# Altium schematic sheet Main.SchDoc
size A; SheetNumber: 1; SheetTotal: 2
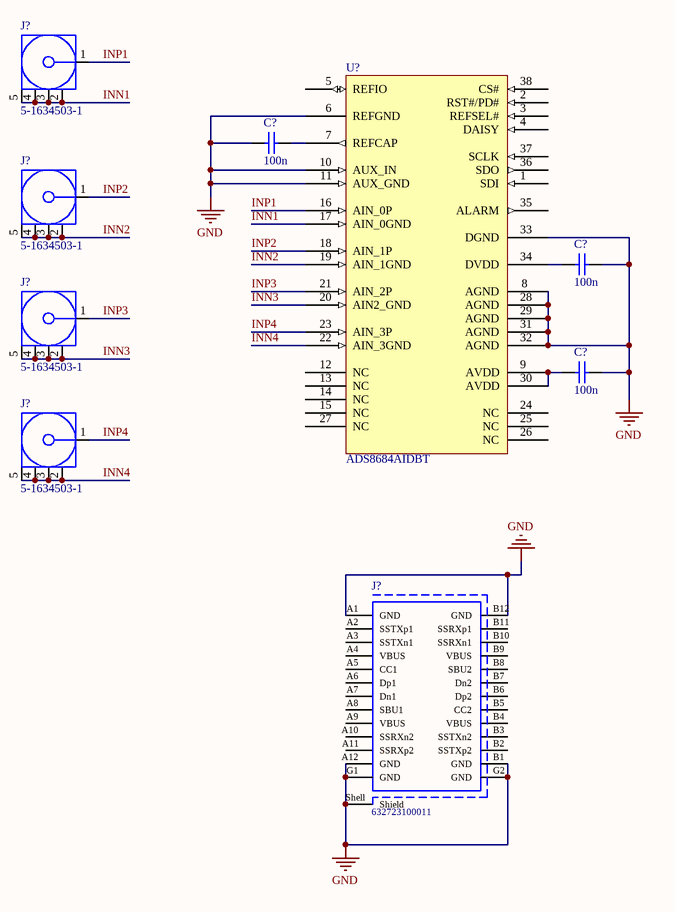
[diagram p0: Main.SchDoc]

## Parts
(Parts that share a designator on the sheet are numbered #1, #2 ... from top to bottom, then left to right.)
C?#1  value 100n  [1608[0603]]  (hidden comment: Cap Semi)
C?#2  value 100n  [1608[0603]]  (hidden comment: Cap Semi)
C?#3  value 100n  [1608[0603]]  (hidden comment: Cap Semi)
J?#1  5-1634503-1  [TECO-5-1634503-1_V]
J?#2  5-1634503-1  [TECO-5-1634503-1_V]
J?#3  5-1634503-1  [TECO-5-1634503-1_V]
J?#4  5-1634503-1  [TECO-5-1634503-1_V]
J?#5  632723100011  [632723100011]
U?  ADS8684AIDBT  [TSSOP50P640X120-38N]

## Nets
GND: C?#1.2 C?#2.2 C?#3.2 J?#5.A1(GND) J?#5.A12(GND) J?#5.B1(GND) J?#5.B12(GND) J?#5.G1(GND) J?#5.G2(GND) J?#5.Shell(Shield) U?.6(REFGND) U?.8(AGND) U?.10(AUX_IN) U?.11(AUX_GND) U?.28(AGND) U?.29(AGND) U?.31(AGND) U?.32(AGND) U?.33(DGND)
INN1: J?#1.2 J?#1.3 J?#1.4 J?#1.5 U?.17(AIN_0GND)
INN2: J?#2.2 J?#2.3 J?#2.4 J?#2.5 U?.19(AIN_1GND)
INN3: J?#3.2 J?#3.3 J?#3.4 J?#3.5 U?.20(AIN2_GND)
INN4: J?#4.2 J?#4.3 J?#4.4 J?#4.5 U?.22(AIN_3GND)
INP1: J?#1.1 U?.16(AIN_0P)
INP2: J?#2.1 U?.18(AIN_1P)
INP3: J?#3.1 U?.21(AIN_2P)
INP4: J?#4.1 U?.23(AIN_3P)
NetC?#1_1: C?#1.1 U?.7(REFCAP)
NetC?#2_1: C?#2.1 U?.34(DVDD)
NetC?#3_1: C?#3.1 U?.9(AVDD) U?.30(AVDD)

Not connected (* = marked no-connect by the designer): J?#5 A2(SSTXp1) A3(SSTXn1) A4(VBUS) A5(CC1) A6(Dp1) A7(Dn1) A8(SBU1) A9(VBUS) A10(SSRXn2) A11(SSRXp2) B2(SSTXp2) B3(SSTXn2) B4(VBUS) B5(CC2) B6(Dp2) B7(Dn2) B8(SBU2) B9(VBUS) B10(SSRXn1) B11(SSRXp1); U? 1(SDI) 2(RST#/PD#) 3(REFSEL#) 4(DAISY) 5(REFIO) 12(NC) 13(NC) 14(NC) 15(NC) 24(NC) 25(NC) 26(NC) 27(NC) 35(ALARM) 36(SDO) 37(SCLK) 38(CS#)

## Library data of the parts
C?#1-C?#3 = Cap Semi: Capacitor (Semiconductor SIM Model); Published: 8-Jun-2000; LatestRevisionDate: 29-May-2009; LatestRevisionNote: IPC-7351 Footprint Added.; PackageReference: C1206; Publisher: Altium Limited; PackageDescription: Chip Capacitor
J?#1-J?#4 = CMP-2000-05626-1: Female Header, Pitch 3.13 mm, Height 13.7 mm, Tail Length 4.5 mm, -55 to 85 degC, RoHS, Bulk; Manufacturer: TE Connectivity; Connector Body Style: StraightJack; Coaxial Termination: Solder; Connector Type: BNCCoaxial; Impedance: 50ohm; Connector Mounting: PCBMount; Frequency Max: 2GHz; SVHC: NoSVHC(15-Jun-2015); Product Range: -; Package Description: Female Header, Pitch 3.13 mm, Height 13.7 mm, Tail Length 4.5 mm; Coaxial Cable Types: -; Manufacturer URL: http://www.te.com/; Mounting Technology: ThroughHole; Datasheet URL: http://www.mouser.com/ds/2/418/NG_CD_1634503_E-657474.pdf; Package Reference: 5-1634503-1; Contact Plating: GoldPlatedContacts; Contact Material: Brass; Datasheet Version: Rev. E, 02/2012
J?#5 = CMP-1502-03213-1: USB 3.1 Type C Receptacle WR-COM, Horizontal, SMT / THT; Manufacturer: Wurth Elektronik; Working Voltage: 20VDC; Rated Current: 5A; Contact Resistance: 30mOhm; Operating Temperature: -40to105degC; Publisher: WurthElektronik; Gender: Receptacle; Part Number: 632723100011; Mounting Technology: SMT/THT; Datasheet URL: https://katalog.we-online.de/em/datasheet/632723x00011%282%29.pdf; Connector Type: USB3.1TypeC; Manufacturer URL: http://www.we-online.de; Orientation: Horizontal; Package Reference: 632723100011; Packaging: TapeandReel
U? = CMP-001-0000-1: 16-Bit 500kSPS 4-Channel SAR ADC With Bipolar Inputs Off 5V Supply 38-TSSOP -40 to 125; Number of A/D Converters: 1; Number of Analog Inputs: 4; Power Consumption: 65mW; Differential Nonlinearity: 1.5LSB; Integral Nonlinearity (INL): 2LSB; Sampling Rate: 500000S/s; Interface: SPI; Signal to Noise Ratio (SNR): 92dB; Max Supply Voltage: 5.25V; Supply Type: Single; Number of Bits: 16; Lead Free: Lead Free; Number of Pins: 38; Max Operating Temperature: 125°C; Mount: Surface Mount; Number of Inputs: 4; RoHS Compliant: Yes; Packaging: Rail/Tube; Min Operating Temperature: -40°C; Polarity: Bipolar; Case/Package: TFSOP; Contact Plating: Gold